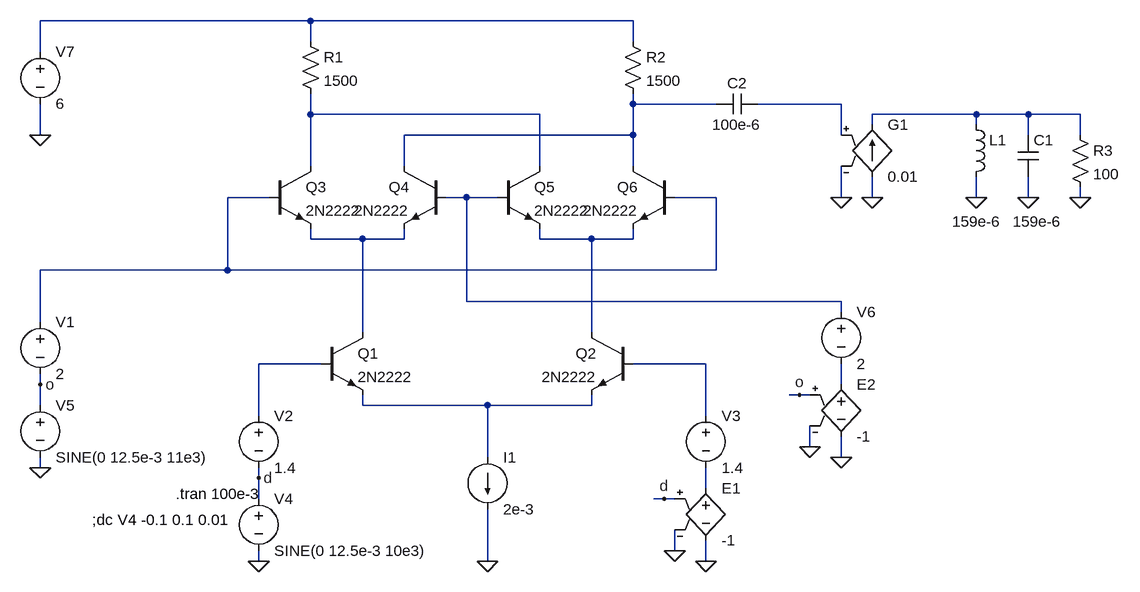
[diagram p0: schematic gilbert.asc]
gilbert.asc, the LTspice schematic file:
Version 4
SHEET 1 1076 680
WIRE -176 -624 -592 -624
WIRE 320 -624 -176 -624
WIRE -176 -592 -176 -624
WIRE 320 -592 320 -624
WIRE -592 -576 -592 -624
WIRE 320 -496 320 -512
WIRE 448 -496 320 -496
WIRE 640 -496 512 -496
WIRE -176 -480 -176 -512
WIRE 176 -480 -176 -480
WIRE 848 -480 688 -480
WIRE 928 -480 848 -480
WIRE 1008 -480 928 -480
WIRE 688 -464 688 -480
WIRE 848 -464 848 -480
WIRE -592 -448 -592 -496
WIRE 320 -448 320 -496
WIRE 320 -448 -32 -448
WIRE 640 -448 640 -496
WIRE 928 -448 928 -480
WIRE 1008 -448 1008 -480
WIRE -176 -400 -176 -480
WIRE -32 -400 -32 -448
WIRE 176 -400 176 -480
WIRE 320 -400 320 -448
WIRE -240 -352 -304 -352
WIRE 64 -352 32 -352
WIRE 112 -352 64 -352
WIRE 448 -352 384 -352
WIRE 640 -352 640 -400
WIRE 688 -352 688 -384
WIRE 848 -352 848 -384
WIRE 928 -352 928 -384
WIRE 1008 -352 1008 -368
WIRE -176 -288 -176 -304
WIRE -96 -288 -176 -288
WIRE -32 -288 -32 -304
WIRE -32 -288 -96 -288
WIRE 176 -288 176 -304
WIRE 256 -288 176 -288
WIRE 320 -288 320 -304
WIRE 320 -288 256 -288
WIRE -304 -240 -304 -352
WIRE -304 -240 -592 -240
WIRE 448 -240 448 -352
WIRE 448 -240 -304 -240
WIRE 64 -192 64 -352
WIRE 640 -192 64 -192
WIRE 640 -176 640 -192
WIRE -592 -160 -592 -240
WIRE -96 -144 -96 -288
WIRE 256 -144 256 -288
WIRE -160 -96 -256 -96
WIRE 432 -96 320 -96
WIRE -592 -64 -592 -80
WIRE 640 -64 640 -96
WIRE 576 -48 560 -48
WIRE 592 -48 576 -48
WIRE -592 -32 -592 -64
WIRE -96 -32 -96 -48
WIRE 96 -32 -96 -32
WIRE 256 -32 256 -48
WIRE 256 -32 96 -32
WIRE -256 -16 -256 -96
WIRE 432 -16 432 -96
WIRE 592 32 592 0
WIRE 96 48 96 -32
WIRE 640 48 640 16
WIRE -592 64 -592 48
WIRE -256 80 -256 64
WIRE 432 96 432 64
WIRE -256 112 -256 80
WIRE 368 112 352 112
WIRE 384 112 368 112
WIRE 384 192 384 160
WIRE -256 208 -256 192
WIRE 96 208 96 128
WIRE 432 208 432 176
FLAG 432 208 0
FLAG -256 208 0
FLAG -256 80 d
FLAG 384 192 0
FLAG 368 112 d
FLAG 96 208 0
FLAG -592 64 0
FLAG 640 48 0
FLAG 592 32 0
FLAG -592 -64 o
FLAG 576 -48 o
FLAG -592 -448 0
FLAG 688 -352 0
FLAG 848 -352 0
FLAG 928 -352 0
FLAG 1008 -352 0
FLAG 640 -352 0
SYMBOL npn -160 -144 R0
SYMATTR InstName Q1
SYMATTR Value 2N2222
SYMBOL npn 320 -144 M0
SYMATTR InstName Q2
SYMATTR Value 2N2222
SYMBOL voltage -256 -32 R0
SYMATTR InstName V2
SYMATTR Value 1.4
SYMBOL voltage 432 -32 R0
SYMATTR InstName V3
SYMATTR Value 1.4
SYMBOL voltage -256 96 R0
WINDOW 123 0 0 Left 2
WINDOW 39 0 0 Left 2
SYMATTR InstName V4
SYMATTR Value SINE(0 12.5e-3 10e3)
SYMBOL e 432 80 R0
SYMATTR InstName E1
SYMATTR Value -1
SYMBOL npn -240 -400 R0
SYMATTR InstName Q3
SYMATTR Value 2N2222
SYMBOL npn 32 -400 M0
SYMATTR InstName Q4
SYMATTR Value 2N2222
SYMBOL npn 112 -400 R0
SYMATTR InstName Q5
SYMATTR Value 2N2222
SYMBOL npn 384 -400 M0
SYMATTR InstName Q6
SYMATTR Value 2N2222
SYMBOL current 96 48 R0
WINDOW 123 0 0 Left 2
WINDOW 39 0 0 Left 2
SYMATTR InstName I1
SYMATTR Value 2e-3
SYMBOL voltage -592 -176 R0
SYMATTR InstName V1
SYMATTR Value 2
SYMBOL voltage -592 -48 R0
WINDOW 123 0 0 Left 2
WINDOW 39 0 0 Left 2
SYMATTR InstName V5
SYMATTR Value SINE(0 12.5e-3 11e3)
SYMBOL voltage 640 -192 R0
SYMATTR InstName V6
SYMATTR Value 2
SYMBOL e 640 -80 R0
SYMATTR InstName E2
SYMATTR Value -1
SYMBOL res -192 -608 R0
SYMATTR InstName R1
SYMATTR Value 1500
SYMBOL res 304 -608 R0
SYMATTR InstName R2
SYMATTR Value 1500
SYMBOL voltage -592 -592 R0
SYMATTR InstName V7
SYMATTR Value 6
SYMBOL ind 832 -480 R0
WINDOW 3 -21 165 Left 2
SYMATTR Value 159e-6
SYMATTR InstName L1
SYMBOL cap 912 -448 R0
WINDOW 3 -8 133 Left 2
SYMATTR Value 159e-6
SYMATTR InstName C1
SYMBOL res 992 -464 R0
SYMATTR InstName R3
SYMATTR Value 100
SYMBOL g 688 -480 R0
SYMATTR InstName G1
SYMATTR Value 0.01
SYMBOL cap 512 -512 R90
WINDOW 0 0 32 VBottom 2
WINDOW 3 32 32 VTop 2
SYMATTR InstName C2
SYMATTR Value 100e-6
TEXT -384 104 Left 2 !.tran 100e-3
TEXT -512 144 Left 2 !;dc V4 -0.1 0.1 0.01

The netlist it stands for:
* gilbert.asc
Q1 N008 N010 N013 0 2N2222
Q2 N009 N011 N013 0 2N2222
V2 N010 d 1.4
V3 N011 N014 1.4
V4 d 0 SINE(0 12.5e-3 10e3)
E1 N014 0 d 0 -1
Q3 N004 N006 N008 0 2N2222
Q4 N002 N007 N008 0 2N2222
Q5 N004 N007 N009 0 2N2222
Q6 N002 N006 N009 0 2N2222
I1 N013 0 2e-3
V1 N006 o 2
V5 o 0 SINE(0 12.5e-3 11e3)
V6 N007 N012 2
E2 N012 0 o 0 -1
R1 N001 N004 1500
R2 N001 N002 1500
V7 N001 0 6
L1 N005 0 159e-6
C1 N005 0 159e-6
R3 N005 0 100
G1 0 N005 N003 0 0.01
C2 N003 N002 100e-6
.model NPN NPN
.model PNP PNP
.lib standard.bjt
.tran 100e-3
;dc V4 -0.1 0.1 0.01
.backanno
.end